# Altium project PROC154E3_SCH.PrjPcb (part 50 of 60)
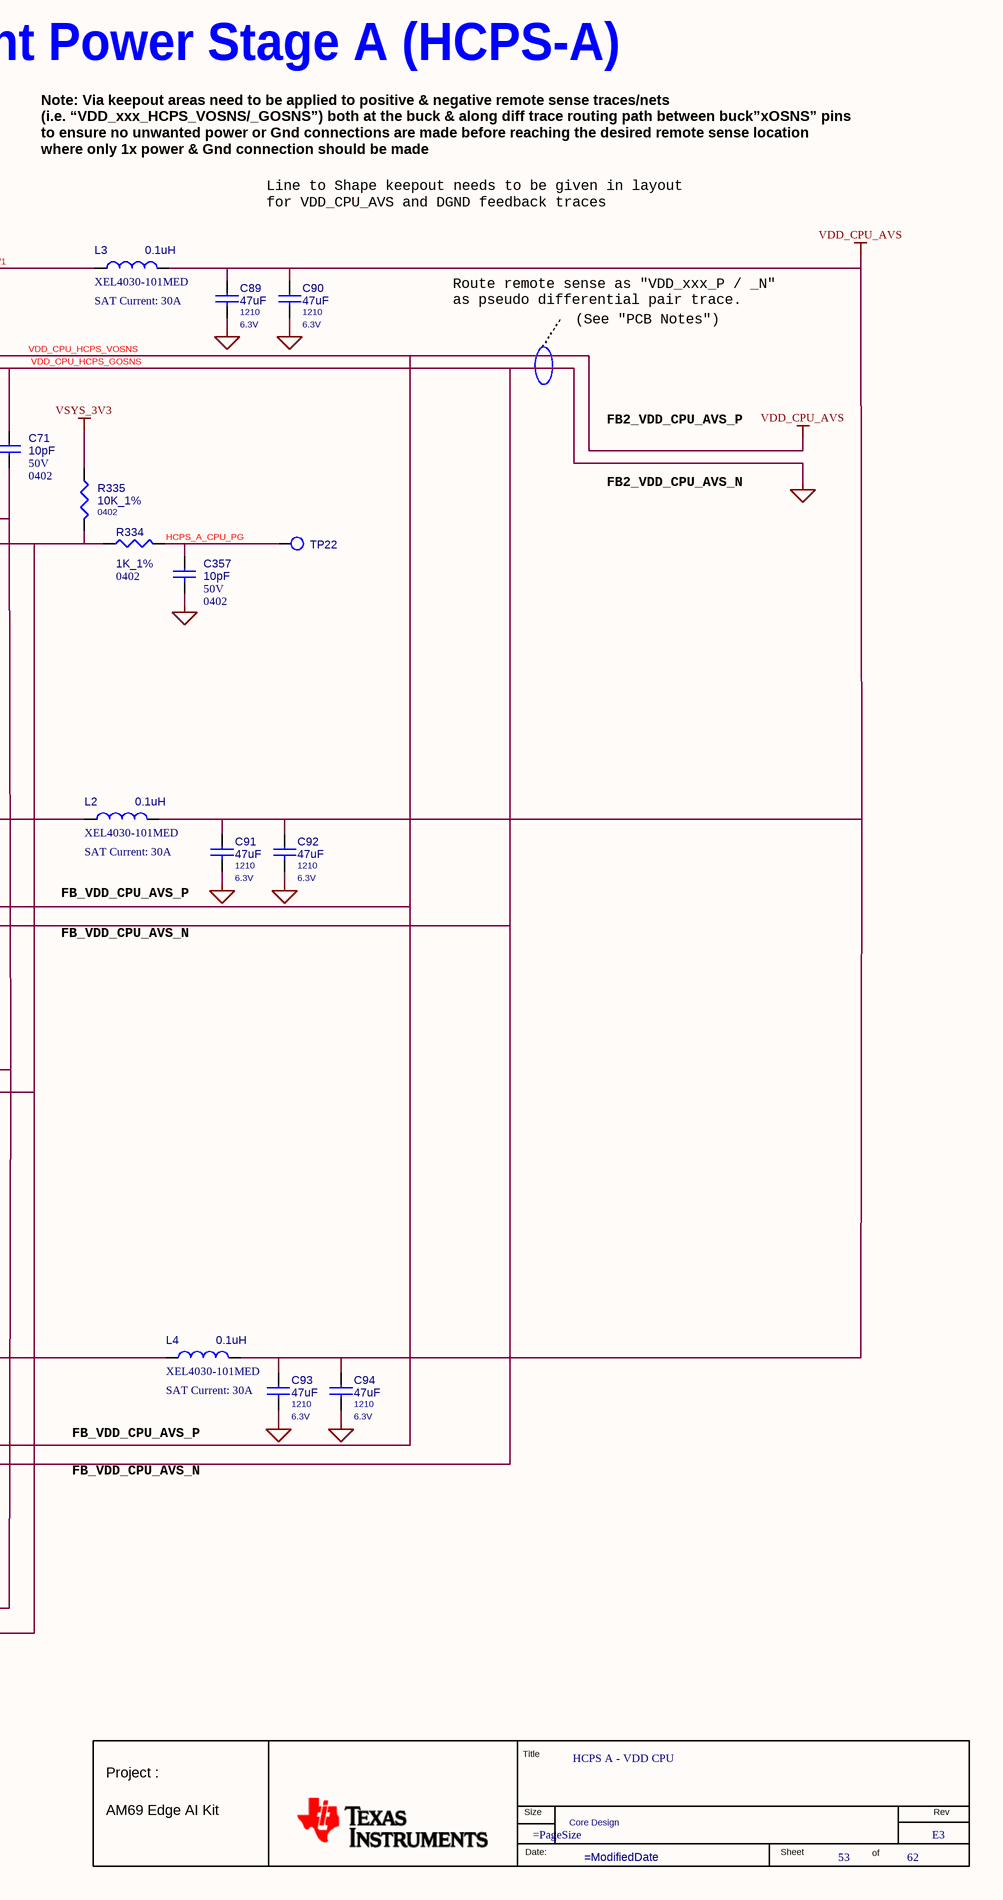
[diagram p190: 53. SOC CPU HCPS-A.SchDoc, right]

## Sheet 53. SOC CPU HCPS-A.SchDoc: HCPS A - VDD CPU (continued)

### Library data of the parts
*#53 = MISTRAL_TITLEBLK_CSIZE_1: as *#51 on sheet 51. POWER SUPPLY #2; Page Create Date: March  8, 1995; Page Size: =PageSize; Page Modify Date: =ModifiedDate; Schematic Page Count: 62; Schematic Page Number: 53
C65 = CAP_Dup1: CAP CERAMIC 10pF 50V 1% C0G(NP0) 0402; Part Reference: C65; Manufacturer: AVX CORPORATION; Automotive Alternate_mfr_part_number: CGA2B1X7R1C104K050BC; Automotive Alternate_mfr_name: TDK; Direct Alternate_mfr_part_number: GCM155R71C104JA55D; Direct Alternate_mfr_name: MURATA; Part_type: CAPACITORS\CERAMIC; Mfr_part_number: 04025U100FAT2A; Mistral Part No: 120014060010-R; Custom_Duty: 15%; Customs_HS_Code: 85322990; Wattage: NA; Project: AEGIS_POM; Value: 10pF; PCB Footprint: CAP0402_0-75; Footprint Path: Y:\MIS_DATABASE\Library\ALTIUM_TOOL\PCB_FOOTPRINTS\Altium_Footprint_Lib.PcbLib; Library Path: Y:\MIS_DATABASE\Library\ALTIUM_TOOL\SCHEMATICS_PARTS\MS_DISCRETE_Library.schlib; MECHANICAL 3D STEP FILE: CAP0402_0-75; Chkd/date: VASANTHA/200614; Crtd /date: NAVEED/170614; Datasheet: Y:\MIS_DATABASE\DATASHEETS\CAPACITORS\AVX_MLC.PDF; Temperature: -55°C+125°C; Weight: 0.65mg; Height: 0.55MM; Library Ref: CAP; Distributor_part_number: 478-5717-1-ND; Distributor_name: DIGIKEY; Tolerance: 1%; Mfr_name: AVX CORPORATION; Footprint Ref: CAP0402_0-75
C66 = CAP_Dup1: CAP CERAMIC 3300pF 50V 10% X7R 0402; Part Reference: C66; Manufacturer: MURATA; Automotive Alternate_mfr_part_number: CGA2B1X7R1C104K050BC; Automotive Alternate_mfr_name: TDK; Direct Alternate_mfr_part_number: GCM155R71C104JA55D; Part_type: CAPACITORS\CERAMIC; Mfr_part_number: GCM155R71H332KA37D; Mistral Part No: 120022080077-R; Custom_Duty: 15%; Customs_HS_Code: 85322990; Wattage: NA; Project: BRUKER_SD820_COMMONDO; Value: 3300pF; PCB Footprint: CAP0402_0-75; Direct Alternate_mfr_name: MURATA; Footprint Path: Y:\MIS_DATABASE\Library\ALTIUM_TOOL\PCB_FOOTPRINTS\Altium_Footprint_Lib.PcbLib; Library Path: Y:\MIS_DATABASE\Library\ALTIUM_TOOL\SCHEMATICS_PARTS\MS_DISCRETE_Library.schlib; MECHANICAL 3D STEP FILE: CAP0402_0-75; Chkd/date: PRAVEEN/300822; Crtd /date: PRAVEEN/300822; Datasheet: Y:\MIS_DATABASE\DATASHEETS\CAPACITORS\GCM155R71H332KA37D.PDF; Temperature: -55°C+125°C; Weight: 1.6mg; Height: 0.55MM; Library Ref: CAP; Distributor_part_number: 490-8001-1-ND; Distributor_name: DIGIKEY; Tolerance: 10%; Mfr_name: MURATA; Footprint Ref: CAP0402_0-75
C67 = CAP_Dup1: CAP CERAMIC 10pF 50V 1% C0G(NP0) 0402; Part Reference: C67; Manufacturer: AVX CORPORATION; Mistral Part No: 120014060010-R; Mfr_part_number: 04025U100FAT2A; Part_type: CAPACITORS\CERAMIC; Direct Alternate_mfr_name: MURATA; Direct Alternate_mfr_part_number: GCM155R71C104JA55D; Automotive Alternate_mfr_name: TDK; Automotive Alternate_mfr_part_number: CGA2B1X7R1C104K050BC; Project: AEGIS_POM; Wattage: NA; Customs_HS_Code: 85322990; Custom_Duty: 15%; Value: 10pF; PCB Footprint: CAP0402_0-75; Footprint Ref: CAP0402_0-75; Mfr_name: AVX CORPORATION; Tolerance: 1%; Distributor_name: DIGIKEY; Distributor_part_number: 478-5717-1-ND; Library Ref: CAP; Height: 0.55MM; Weight: 0.65mg; Temperature: -55°C+125°C; Datasheet: Y:\MIS_DATABASE\DATASHEETS\CAPACITORS\AVX_MLC.PDF; Crtd /date: NAVEED/170614; Chkd/date: VASANTHA/200614; MECHANICAL 3D STEP FILE: CAP0402_0-75; Library Path: Y:\MIS_DATABASE\Library\ALTIUM_TOOL\SCHEMATICS_PARTS\MS_DISCRETE_Library.schlib; Footprint Path: Y:\MIS_DATABASE\Library\ALTIUM_TOOL\PCB_FOOTPRINTS\Altium_Footprint_Lib.PcbLib
C71 = CAP_Dup1: CAP CERAMIC 10pF 50V 1% C0G(NP0) 0402; Part Reference: C71; Manufacturer: AVX CORPORATION; Mistral Part No: 120014060010-R; Mfr_part_number: 04025U100FAT2A; Part_type: CAPACITORS\CERAMIC; Direct Alternate_mfr_name: MURATA; Direct Alternate_mfr_part_number: GCM155R71C104JA55D; Automotive Alternate_mfr_name: TDK; Automotive Alternate_mfr_part_number: CGA2B1X7R1C104K050BC; Project: AEGIS_POM; Wattage: NA; Customs_HS_Code: 85322990; Custom_Duty: 15%; Value: 10pF; PCB Footprint: CAP0402_0-75; Footprint Ref: CAP0402_0-75; Mfr_name: AVX CORPORATION; Tolerance: 1%; Distributor_name: DIGIKEY; Distributor_part_number: 478-5717-1-ND; Library Ref: CAP; Height: 0.55MM; Weight: 0.65mg; Temperature: -55°C+125°C; Datasheet: Y:\MIS_DATABASE\DATASHEETS\CAPACITORS\AVX_MLC.PDF; Crtd /date: NAVEED/170614; Chkd/date: VASANTHA/200614; MECHANICAL 3D STEP FILE: CAP0402_0-75; Library Path: Y:\MIS_DATABASE\Library\ALTIUM_TOOL\SCHEMATICS_PARTS\MS_DISCRETE_Library.schlib; Footprint Path: Y:\MIS_DATABASE\Library\ALTIUM_TOOL\PCB_FOOTPRINTS\Altium_Footprint_Lib.PcbLib
C89 = CAP_Dup1: CAP CERAMIC 47uF 6.3V 10% X7R AUTO 1210; Part Reference: C89; Manufacturer: MURATA; Automotive Alternate_mfr_part_number: CGA6P1X7S1A476M; Automotive Alternate_mfr_name: TDK; Part_type: CAPACITORS\CERAMIC; Mfr_part_number: GCM32ER70J476KE19L; Mistral Part No: 120018090056-R; Custom_Duty: 15%; Customs_HS_Code: 85322990; Wattage: NA; Project: TI_J7_SVB-DUT; Value: 47uF; PCB Footprint: CAP1210_2-75; Direct Alternate_mfr_part_number: CGA6P1X7S1A476M; Direct Alternate_mfr_name: TDK; Footprint Path: Y:\MIS_DATABASE\Library\ALTIUM_TOOL\PCB_FOOTPRINTS\Altium_Footprint_Lib.PcbLib; Library Path: Y:\MIS_DATABASE\Library\ALTIUM_TOOL\SCHEMATICS_PARTS\MS_DISCRETE_Library.schlib; MECHANICAL 3D STEP FILE: CAP1210_2-75; Chkd/date: MANIRAJA/280918; Crtd /date: ALVY/280918; Datasheet: Y:\MIS_DATABASE\DATASHEETS\CAPACITORS\MURATA-GCM-SER.PDF; Temperature: -55°C+125°C; Weight: 110mg; Height: 2.70MM; Library Ref: CAP; Distributor_part_number: 490-4844-1-ND; Distributor_name: DIGIKEY; Tolerance: 10%; Mfr_name: MURATA; Footprint Ref: CAP1210_2-75
C90 = CAP_Dup1: CAP CERAMIC 47uF 6.3V 10% X7R AUTO 1210; Part Reference: C90; Manufacturer: MURATA; Automotive Alternate_mfr_part_number: CGA6P1X7S1A476M; Automotive Alternate_mfr_name: TDK; Part_type: CAPACITORS\CERAMIC; Mfr_part_number: GCM32ER70J476KE19L; Mistral Part No: 120018090056-R; Custom_Duty: 15%; Customs_HS_Code: 85322990; Wattage: NA; Project: TI_J7_SVB-DUT; Value: 47uF; PCB Footprint: CAP1210_2-75; Direct Alternate_mfr_part_number: CGA6P1X7S1A476M; Direct Alternate_mfr_name: TDK; Footprint Path: Y:\MIS_DATABASE\Library\ALTIUM_TOOL\PCB_FOOTPRINTS\Altium_Footprint_Lib.PcbLib; Library Path: Y:\MIS_DATABASE\Library\ALTIUM_TOOL\SCHEMATICS_PARTS\MS_DISCRETE_Library.schlib; MECHANICAL 3D STEP FILE: CAP1210_2-75; Chkd/date: MANIRAJA/280918; Crtd /date: ALVY/280918; Datasheet: Y:\MIS_DATABASE\DATASHEETS\CAPACITORS\MURATA-GCM-SER.PDF; Temperature: -55°C+125°C; Weight: 110mg; Height: 2.70MM; Library Ref: CAP; Distributor_part_number: 490-4844-1-ND; Distributor_name: DIGIKEY; Tolerance: 10%; Mfr_name: MURATA; Footprint Ref: CAP1210_2-75
C91 = CAP_Dup1: CAP CERAMIC 47uF 6.3V 10% X7R AUTO 1210; Part Reference: C91; Manufacturer: MURATA; Automotive Alternate_mfr_part_number: CGA6P1X7S1A476M; Automotive Alternate_mfr_name: TDK; Part_type: CAPACITORS\CERAMIC; Mfr_part_number: GCM32ER70J476KE19L; Mistral Part No: 120018090056-R; Custom_Duty: 15%; Customs_HS_Code: 85322990; Wattage: NA; Project: TI_J7_SVB-DUT; Value: 47uF; PCB Footprint: CAP1210_2-75; Direct Alternate_mfr_part_number: CGA6P1X7S1A476M; Direct Alternate_mfr_name: TDK; Footprint Path: Y:\MIS_DATABASE\Library\ALTIUM_TOOL\PCB_FOOTPRINTS\Altium_Footprint_Lib.PcbLib; Library Path: Y:\MIS_DATABASE\Library\ALTIUM_TOOL\SCHEMATICS_PARTS\MS_DISCRETE_Library.schlib; MECHANICAL 3D STEP FILE: CAP1210_2-75; Chkd/date: MANIRAJA/280918; Crtd /date: ALVY/280918; Datasheet: Y:\MIS_DATABASE\DATASHEETS\CAPACITORS\MURATA-GCM-SER.PDF; Temperature: -55°C+125°C; Weight: 110mg; Height: 2.70MM; Library Ref: CAP; Distributor_part_number: 490-4844-1-ND; Distributor_name: DIGIKEY; Tolerance: 10%; Mfr_name: MURATA; Footprint Ref: CAP1210_2-75
C92 = CAP_Dup1: CAP CERAMIC 47uF 6.3V 10% X7R AUTO 1210; Part Reference: C92; Manufacturer: MURATA; Automotive Alternate_mfr_part_number: CGA6P1X7S1A476M; Automotive Alternate_mfr_name: TDK; Part_type: CAPACITORS\CERAMIC; Mfr_part_number: GCM32ER70J476KE19L; Mistral Part No: 120018090056-R; Custom_Duty: 15%; Customs_HS_Code: 85322990; Wattage: NA; Project: TI_J7_SVB-DUT; Value: 47uF; PCB Footprint: CAP1210_2-75; Direct Alternate_mfr_part_number: CGA6P1X7S1A476M; Direct Alternate_mfr_name: TDK; Footprint Path: Y:\MIS_DATABASE\Library\ALTIUM_TOOL\PCB_FOOTPRINTS\Altium_Footprint_Lib.PcbLib; Library Path: Y:\MIS_DATABASE\Library\ALTIUM_TOOL\SCHEMATICS_PARTS\MS_DISCRETE_Library.schlib; MECHANICAL 3D STEP FILE: CAP1210_2-75; Chkd/date: MANIRAJA/280918; Crtd /date: ALVY/280918; Datasheet: Y:\MIS_DATABASE\DATASHEETS\CAPACITORS\MURATA-GCM-SER.PDF; Temperature: -55°C+125°C; Weight: 110mg; Height: 2.70MM; Library Ref: CAP; Distributor_part_number: 490-4844-1-ND; Distributor_name: DIGIKEY; Tolerance: 10%; Mfr_name: MURATA; Footprint Ref: CAP1210_2-75
C93 = CAP_Dup1: CAP CERAMIC 47uF 6.3V 10% X7R AUTO 1210; Part Reference: C93; Manufacturer: MURATA; Mistral Part No: 120018090056-R; Mfr_part_number: GCM32ER70J476KE19L; Part_type: CAPACITORS\CERAMIC; Direct Alternate_mfr_name: TDK; Direct Alternate_mfr_part_number: CGA6P1X7S1A476M; Project: TI_J7_SVB-DUT; Wattage: NA; Customs_HS_Code: 85322990; Custom_Duty: 15%; Value: 47uF; PCB Footprint: CAP1210_2-75; Footprint Ref: CAP1210_2-75; Mfr_name: MURATA; Tolerance: 10%; Distributor_name: DIGIKEY; Distributor_part_number: 490-4844-1-ND; Library Ref: CAP; Height: 2.70MM; Weight: 110mg; Temperature: -55°C+125°C; Datasheet: Y:\MIS_DATABASE\DATASHEETS\CAPACITORS\MURATA-GCM-SER.PDF; Crtd /date: ALVY/280918; Chkd/date: MANIRAJA/280918; MECHANICAL 3D STEP FILE: CAP1210_2-75; Library Path: Y:\MIS_DATABASE\Library\ALTIUM_TOOL\SCHEMATICS_PARTS\MS_DISCRETE_Library.schlib; Footprint Path: Y:\MIS_DATABASE\Library\ALTIUM_TOOL\PCB_FOOTPRINTS\Altium_Footprint_Lib.PcbLib; Automotive Alternate_mfr_name: TDK; Automotive Alternate_mfr_part_number: CGA6P1X7S1A476M
C94 = CAP_Dup1: CAP CERAMIC 47uF 6.3V 10% X7R AUTO 1210; Part Reference: C94; Manufacturer: MURATA; Mistral Part No: 120018090056-R; Mfr_part_number: GCM32ER70J476KE19L; Part_type: CAPACITORS\CERAMIC; Direct Alternate_mfr_name: TDK; Direct Alternate_mfr_part_number: CGA6P1X7S1A476M; Project: TI_J7_SVB-DUT; Wattage: NA; Customs_HS_Code: 85322990; Custom_Duty: 15%; Value: 47uF; PCB Footprint: CAP1210_2-75; Footprint Ref: CAP1210_2-75; Mfr_name: MURATA; Tolerance: 10%; Distributor_name: DIGIKEY; Distributor_part_number: 490-4844-1-ND; Library Ref: CAP; Height: 2.70MM; Weight: 110mg; Temperature: -55°C+125°C; Datasheet: Y:\MIS_DATABASE\DATASHEETS\CAPACITORS\MURATA-GCM-SER.PDF; Crtd /date: ALVY/280918; Chkd/date: MANIRAJA/280918; MECHANICAL 3D STEP FILE: CAP1210_2-75; Library Path: Y:\MIS_DATABASE\Library\ALTIUM_TOOL\SCHEMATICS_PARTS\MS_DISCRETE_Library.schlib; Footprint Path: Y:\MIS_DATABASE\Library\ALTIUM_TOOL\PCB_FOOTPRINTS\Altium_Footprint_Lib.PcbLib; Automotive Alternate_mfr_name: TDK; Automotive Alternate_mfr_part_number: CGA6P1X7S1A476M
C357 = CAP_Dup1: CAP CERAMIC 10pF 50V 1% C0G(NP0) 0402; Part Reference: C357; Manufacturer: AVX CORPORATION; Automotive Alternate_mfr_part_number: CGA2B1X7R1C104K050BC; Automotive Alternate_mfr_name: TDK; Direct Alternate_mfr_part_number: GCM155R71C104JA55D; Direct Alternate_mfr_name: MURATA; Part_type: CAPACITORS\CERAMIC; Mfr_part_number: 04025U100FAT2A; Mistral Part No: 120014060010-R; Custom_Duty: 15%; Customs_HS_Code: 85322990; Wattage: NA; Project: AEGIS_POM; Value: 10pF; PCB Footprint: CAP0402_0-75; Footprint Path: Y:\MIS_DATABASE\Library\ALTIUM_TOOL\PCB_FOOTPRINTS\Altium_Footprint_Lib.PcbLib; Library Path: Y:\MIS_DATABASE\Library\ALTIUM_TOOL\SCHEMATICS_PARTS\MS_DISCRETE_Library.schlib; MECHANICAL 3D STEP FILE: CAP0402_0-75; Chkd/date: VASANTHA/200614; Crtd /date: NAVEED/170614; Datasheet: Y:\MIS_DATABASE\DATASHEETS\CAPACITORS\AVX_MLC.PDF; Temperature: -55°C+125°C; Weight: 0.65mg; Height: 0.55MM; Library Ref: CAP; Distributor_part_number: 478-5717-1-ND; Distributor_name: DIGIKEY; Tolerance: 1%; Mfr_name: AVX CORPORATION; Footprint Ref: CAP0402_0-75
FL1 = CAP_NFM_TI: PASSIVE FILTER EMI 10uF 4V AUTO 0603; Part Reference: FL1; Mistral Part No: 130018100049; Mfr_name: MURATA; Mfr_part_number: NFM18HC106D0G_TI; Project: TI_J7ES_EVM_SOM; Tolerance: NA; Customs_HS_Code: 85412900; Custom_Duty: 15%; Value: 10uF; Footprint Ref: EMIFIL_NFM18C_0603_0-7_TI; Part_type: FILTER; Voltage: 4V; Wattage: NA; Package: 0603; Distributor_name: NA; Distributor_part_number: NA; Library Ref: CAP_NFM_TI; PCB Footprint: EMIFIL_NFM18C_0603_0-7_TI; Height: 0.70MM; Weight: NA; Temperature: NA; Datasheet: Y:\MIS_DATABASE\DATASHEETS\DISCRETES\INDUCTORS\NFM18HC-SER.PDF; Crtd /date: ALVY/251018; Chkd/date: MANIRAJA/251018; RoHS: NA; MECHANICAL 3D STEP FILE: EMIFIL_NFM18C_0603_0-7_TI; Library Path: Y:\MIS_DATABASE\Library\ALTIUM_TOOL\SCHEMATICS_PARTS\MS_FILTER_Library.schlib; Footprint Path: Y:\MIS_DATABASE\Library\ALTIUM_TOOL\PCB_FOOTPRINTS\Altium_Footprint_Lib.PcbLib
FL2 = CAP_NFM_TI: PASSIVE FILTER EMI 10uF 4V AUTO 0603; Part Reference: FL2; Mistral Part No: 130018100049; Mfr_name: MURATA; Mfr_part_number: NFM18HC106D0G_TI; Project: TI_J7ES_EVM_SOM; Tolerance: NA; Customs_HS_Code: 85412900; Custom_Duty: 15%; Value: 10uF; Footprint Ref: EMIFIL_NFM18C_0603_0-7_TI; Part_type: FILTER; Voltage: 4V; Wattage: NA; Package: 0603; Distributor_name: NA; Distributor_part_number: NA; Library Ref: CAP_NFM_TI; PCB Footprint: EMIFIL_NFM18C_0603_0-7_TI; Height: 0.70MM; Weight: NA; Temperature: NA; Datasheet: Y:\MIS_DATABASE\DATASHEETS\DISCRETES\INDUCTORS\NFM18HC-SER.PDF; Crtd /date: ALVY/251018; Chkd/date: MANIRAJA/251018; RoHS: NA; MECHANICAL 3D STEP FILE: EMIFIL_NFM18C_0603_0-7_TI; Library Path: Y:\MIS_DATABASE\Library\ALTIUM_TOOL\SCHEMATICS_PARTS\MS_FILTER_Library.schlib; Footprint Path: Y:\MIS_DATABASE\Library\ALTIUM_TOOL\PCB_FOOTPRINTS\Altium_Footprint_Lib.PcbLib
FL3 = CAP_NFM_TI: PASSIVE FILTER EMI 10uF 4V AUTO 0603; Part Reference: FL3; Mistral Part No: 130018100049; Mfr_name: MURATA; Mfr_part_number: NFM18HC106D0G_TI; Project: TI_J7ES_EVM_SOM; Tolerance: NA; Customs_HS_Code: 85412900; Custom_Duty: 15%; Value: 10uF; Footprint Ref: EMIFIL_NFM18C_0603_0-7_TI; Part_type: FILTER; Voltage: 4V; Wattage: NA; Package: 0603; Distributor_name: NA; Distributor_part_number: NA; Library Ref: CAP_NFM_TI; PCB Footprint: EMIFIL_NFM18C_0603_0-7_TI; Height: 0.70MM; Weight: NA; Temperature: NA; Datasheet: Y:\MIS_DATABASE\DATASHEETS\DISCRETES\INDUCTORS\NFM18HC-SER.PDF; Crtd /date: ALVY/251018; Chkd/date: MANIRAJA/251018; RoHS: NA; MECHANICAL 3D STEP FILE: EMIFIL_NFM18C_0603_0-7_TI; Library Path: Y:\MIS_DATABASE\Library\ALTIUM_TOOL\SCHEMATICS_PARTS\MS_FILTER_Library.schlib; Footprint Path: Y:\MIS_DATABASE\Library\ALTIUM_TOOL\PCB_FOOTPRINTS\Altium_Footprint_Lib.PcbLib
FL4 = CAP_NFM_TI: PASSIVE FILTER EMI 10uF 4V AUTO 0603; Part Reference: FL4; Mistral Part No: 130018100049; Mfr_name: MURATA; Mfr_part_number: NFM18HC106D0G_TI; Project: TI_J7ES_EVM_SOM; Tolerance: NA; Customs_HS_Code: 85412900; Custom_Duty: 15%; Value: 10uF; Footprint Ref: EMIFIL_NFM18C_0603_0-7_TI; Part_type: FILTER; Voltage: 4V; Wattage: NA; Package: 0603; Distributor_name: NA; Distributor_part_number: NA; Library Ref: CAP_NFM_TI; PCB Footprint: EMIFIL_NFM18C_0603_0-7_TI; Height: 0.70MM; Weight: NA; Temperature: NA; Datasheet: Y:\MIS_DATABASE\DATASHEETS\DISCRETES\INDUCTORS\NFM18HC-SER.PDF; Crtd /date: ALVY/251018; Chkd/date: MANIRAJA/251018; RoHS: NA; MECHANICAL 3D STEP FILE: EMIFIL_NFM18C_0603_0-7_TI; Library Path: Y:\MIS_DATABASE\Library\ALTIUM_TOOL\SCHEMATICS_PARTS\MS_FILTER_Library.schlib; Footprint Path: Y:\MIS_DATABASE\Library\ALTIUM_TOOL\PCB_FOOTPRINTS\Altium_Footprint_Lib.PcbLib
FL5 = CAP_NFM_TI: PASSIVE FILTER EMI 10uF 4V AUTO 0603; Part Reference: FL5; Mistral Part No: 130018100049; Mfr_name: MURATA; Mfr_part_number: NFM18HC106D0G_TI; Project: TI_J7ES_EVM_SOM; Tolerance: NA; Customs_HS_Code: 85412900; Custom_Duty: 15%; Value: 10uF; Footprint Ref: EMIFIL_NFM18C_0603_0-7_TI; Part_type: FILTER; Voltage: 4V; Wattage: NA; Package: 0603; Distributor_name: NA; Distributor_part_number: NA; Library Ref: CAP_NFM_TI; PCB Footprint: EMIFIL_NFM18C_0603_0-7_TI; Height: 0.70MM; Weight: NA; Temperature: NA; Datasheet: Y:\MIS_DATABASE\DATASHEETS\DISCRETES\INDUCTORS\NFM18HC-SER.PDF; Crtd /date: ALVY/251018; Chkd/date: MANIRAJA/251018; RoHS: NA; MECHANICAL 3D STEP FILE: EMIFIL_NFM18C_0603_0-7_TI; Library Path: Y:\MIS_DATABASE\Library\ALTIUM_TOOL\SCHEMATICS_PARTS\MS_FILTER_Library.schlib; Footprint Path: Y:\MIS_DATABASE\Library\ALTIUM_TOOL\PCB_FOOTPRINTS\Altium_Footprint_Lib.PcbLib
FL6 = CAP_NFM_TI: PASSIVE FILTER EMI 10uF 4V AUTO 0603; Part Reference: FL6; Mistral Part No: 130018100049; Mfr_name: MURATA; Mfr_part_number: NFM18HC106D0G_TI; Project: TI_J7ES_EVM_SOM; Tolerance: NA; Customs_HS_Code: 85412900; Custom_Duty: 15%; Value: 10uF; Footprint Ref: EMIFIL_NFM18C_0603_0-7_TI; Part_type: FILTER; Voltage: 4V; Wattage: NA; Package: 0603; Distributor_name: NA; Distributor_part_number: NA; Library Ref: CAP_NFM_TI; PCB Footprint: EMIFIL_NFM18C_0603_0-7_TI; Height: 0.70MM; Weight: NA; Temperature: NA; Datasheet: Y:\MIS_DATABASE\DATASHEETS\DISCRETES\INDUCTORS\NFM18HC-SER.PDF; Crtd /date: ALVY/251018; Chkd/date: MANIRAJA/251018; RoHS: NA; MECHANICAL 3D STEP FILE: EMIFIL_NFM18C_0603_0-7_TI; Library Path: Y:\MIS_DATABASE\Library\ALTIUM_TOOL\SCHEMATICS_PARTS\MS_FILTER_Library.schlib; Footprint Path: Y:\MIS_DATABASE\Library\ALTIUM_TOOL\PCB_FOOTPRINTS\Altium_Footprint_Lib.PcbLib
FL7 = CAP_NFM_TI: PASSIVE FILTER EMI 10uF 4V AUTO 0603; Part Reference: FL7; Mistral Part No: 130018100049; Mfr_name: MURATA; Mfr_part_number: NFM18HC106D0G_TI; Project: TI_J7ES_EVM_SOM; Tolerance: NA; Customs_HS_Code: 85412900; Custom_Duty: 15%; Value: 10uF; Footprint Ref: EMIFIL_NFM18C_0603_0-7_TI; Part_type: FILTER; Voltage: 4V; Wattage: NA; Package: 0603; Distributor_name: NA; Distributor_part_number: NA; Library Ref: CAP_NFM_TI; PCB Footprint: EMIFIL_NFM18C_0603_0-7_TI; Height: 0.70MM; Weight: NA; Temperature: NA; Datasheet: Y:\MIS_DATABASE\DATASHEETS\DISCRETES\INDUCTORS\NFM18HC-SER.PDF; Crtd /date: ALVY/251018; Chkd/date: MANIRAJA/251018; RoHS: NA; MECHANICAL 3D STEP FILE: EMIFIL_NFM18C_0603_0-7_TI; Library Path: Y:\MIS_DATABASE\Library\ALTIUM_TOOL\SCHEMATICS_PARTS\MS_FILTER_Library.schlib; Footprint Path: Y:\MIS_DATABASE\Library\ALTIUM_TOOL\PCB_FOOTPRINTS\Altium_Footprint_Lib.PcbLib
FL8 = CAP_NFM_TI: PASSIVE FILTER EMI 10uF 4V AUTO 0603; Part Reference: FL8; Mistral Part No: 130018100049; Mfr_name: MURATA; Mfr_part_number: NFM18HC106D0G_TI; Project: TI_J7ES_EVM_SOM; Tolerance: NA; Customs_HS_Code: 85412900; Custom_Duty: 15%; Value: 10uF; Footprint Ref: EMIFIL_NFM18C_0603_0-7_TI; Part_type: FILTER; Voltage: 4V; Wattage: NA; Package: 0603; Distributor_name: NA; Distributor_part_number: NA; Library Ref: CAP_NFM_TI; PCB Footprint: EMIFIL_NFM18C_0603_0-7_TI; Height: 0.70MM; Weight: NA; Temperature: NA; Datasheet: Y:\MIS_DATABASE\DATASHEETS\DISCRETES\INDUCTORS\NFM18HC-SER.PDF; Crtd /date: ALVY/251018; Chkd/date: MANIRAJA/251018; RoHS: NA; MECHANICAL 3D STEP FILE: EMIFIL_NFM18C_0603_0-7_TI; Library Path: Y:\MIS_DATABASE\Library\ALTIUM_TOOL\SCHEMATICS_PARTS\MS_FILTER_Library.schlib; Footprint Path: Y:\MIS_DATABASE\Library\ALTIUM_TOOL\PCB_FOOTPRINTS\Altium_Footprint_Lib.PcbLib
FL9 = CAP_NFM_TI: PASSIVE FILTER EMI 10uF 4V AUTO 0603; Part Reference: FL9; Mistral Part No: 130018100049; Mfr_name: MURATA; Mfr_part_number: NFM18HC106D0G_TI; Project: TI_J7ES_EVM_SOM; Tolerance: NA; Customs_HS_Code: 85412900; Custom_Duty: 15%; Value: 10uF; Footprint Ref: EMIFIL_NFM18C_0603_0-7_TI; Part_type: FILTER; Voltage: 4V; Wattage: NA; Package: 0603; Distributor_name: NA; Distributor_part_number: NA; Library Ref: CAP_NFM_TI; PCB Footprint: EMIFIL_NFM18C_0603_0-7_TI; Height: 0.70MM; Weight: NA; Temperature: NA; Datasheet: Y:\MIS_DATABASE\DATASHEETS\DISCRETES\INDUCTORS\NFM18HC-SER.PDF; Crtd /date: ALVY/251018; Chkd/date: MANIRAJA/251018; RoHS: NA; MECHANICAL 3D STEP FILE: EMIFIL_NFM18C_0603_0-7_TI; Library Path: Y:\MIS_DATABASE\Library\ALTIUM_TOOL\SCHEMATICS_PARTS\MS_FILTER_Library.schlib; Footprint Path: Y:\MIS_DATABASE\Library\ALTIUM_TOOL\PCB_FOOTPRINTS\Altium_Footprint_Lib.PcbLib
FL10 = CAP_NFM_TI: PASSIVE FILTER EMI 10uF 4V AUTO 0603; Part Reference: FL10; Mistral Part No: 130018100049; Mfr_name: MURATA; Mfr_part_number: NFM18HC106D0G_TI; Project: TI_J7ES_EVM_SOM; Tolerance: NA; Customs_HS_Code: 85412900; Custom_Duty: 15%; Value: 10uF; Footprint Ref: EMIFIL_NFM18C_0603_0-7_TI; Part_type: FILTER; Voltage: 4V; Wattage: NA; Package: 0603; Distributor_name: NA; Distributor_part_number: NA; Library Ref: CAP_NFM_TI; PCB Footprint: EMIFIL_NFM18C_0603_0-7_TI; Height: 0.70MM; Weight: NA; Temperature: NA; Datasheet: Y:\MIS_DATABASE\DATASHEETS\DISCRETES\INDUCTORS\NFM18HC-SER.PDF; Crtd /date: ALVY/251018; Chkd/date: MANIRAJA/251018; RoHS: NA; MECHANICAL 3D STEP FILE: EMIFIL_NFM18C_0603_0-7_TI; Library Path: Y:\MIS_DATABASE\Library\ALTIUM_TOOL\SCHEMATICS_PARTS\MS_FILTER_Library.schlib; Footprint Path: Y:\MIS_DATABASE\Library\ALTIUM_TOOL\PCB_FOOTPRINTS\Altium_Footprint_Lib.PcbLib
FL11 = CAP_NFM_TI: PASSIVE FILTER EMI 10uF 4V AUTO 0603; Part Reference: FL11; Mistral Part No: 130018100049; Mfr_name: MURATA; Mfr_part_number: NFM18HC106D0G_TI; Project: TI_J7ES_EVM_SOM; Tolerance: NA; Customs_HS_Code: 85412900; Custom_Duty: 15%; Value: 10uF; Footprint Ref: EMIFIL_NFM18C_0603_0-7_TI; Part_type: FILTER; Voltage: 4V; Wattage: NA; Package: 0603; Distributor_name: NA; Distributor_part_number: NA; Library Ref: CAP_NFM_TI; PCB Footprint: EMIFIL_NFM18C_0603_0-7_TI; Height: 0.70MM; Weight: NA; Temperature: NA; Datasheet: Y:\MIS_DATABASE\DATASHEETS\DISCRETES\INDUCTORS\NFM18HC-SER.PDF; Crtd /date: ALVY/251018; Chkd/date: MANIRAJA/251018; RoHS: NA; MECHANICAL 3D STEP FILE: EMIFIL_NFM18C_0603_0-7_TI; Library Path: Y:\MIS_DATABASE\Library\ALTIUM_TOOL\SCHEMATICS_PARTS\MS_FILTER_Library.schlib; Footprint Path: Y:\MIS_DATABASE\Library\ALTIUM_TOOL\PCB_FOOTPRINTS\Altium_Footprint_Lib.PcbLib
FL12 = CAP_NFM_TI: PASSIVE FILTER EMI 10uF 4V AUTO 0603; Part Reference: FL12; Mistral Part No: 130018100049; Mfr_name: MURATA; Mfr_part_number: NFM18HC106D0G_TI; Project: TI_J7ES_EVM_SOM; Tolerance: NA; Customs_HS_Code: 85412900; Custom_Duty: 15%; Value: 10uF; Footprint Ref: EMIFIL_NFM18C_0603_0-7_TI; Part_type: FILTER; Voltage: 4V; Wattage: NA; Package: 0603; Distributor_name: NA; Distributor_part_number: NA; Library Ref: CAP_NFM_TI; PCB Footprint: EMIFIL_NFM18C_0603_0-7_TI; Height: 0.70MM; Weight: NA; Temperature: NA; Datasheet: Y:\MIS_DATABASE\DATASHEETS\DISCRETES\INDUCTORS\NFM18HC-SER.PDF; Crtd /date: ALVY/251018; Chkd/date: MANIRAJA/251018; RoHS: NA; MECHANICAL 3D STEP FILE: EMIFIL_NFM18C_0603_0-7_TI; Library Path: Y:\MIS_DATABASE\Library\ALTIUM_TOOL\SCHEMATICS_PARTS\MS_FILTER_Library.schlib; Footprint Path: Y:\MIS_DATABASE\Library\ALTIUM_TOOL\PCB_FOOTPRINTS\Altium_Footprint_Lib.PcbLib
L2 = INDUCTOR: IND POWER 0.1uH 25.8A 20% SMD; Part Reference: L2; Manufacturer: COILCRAFT; Part #: 105324-1470R; Mistral Part No: 130022010018-R; Custom_Duty: 24%; Customs_HS_Code: 85437099; Wattage: NA; Project: J7AHP_PROTO_BRD; Value: 0.1uH; PCB Footprint: IND_XEL4030_170X170_SMD_3-2; Footprint Path: Y:\MIS_DATABASE\Library\ALTIUM_TOOL\PCB_FOOTPRINTS\Altium_Footprint_Lib.PcbLib; Library Path: Y:\MIS_DATABASE\Library\ALTIUM_TOOL\SCHEMATICS_PARTS\MS_DISCRETE_Library.schlib; MECHANICAL 3D STEP FILE: IND_XEL4030_170X170_SMD_3-2; Chkd/date: MANIRAJA/170122; Crtd /date: TAMILARASU/170122; Datasheet: Y:\MIS_DATABASE\DATASHEETS\DISCRETES\INDUCTORS\XEL4030_JUN20.PDF; Temperature: -40°C+125°C; Weight: 280mg; Height: 3.20MM; Library Ref: INDUCTOR; Distributor_part_number: 994-XEL4030-101MED; Distributor_name: MOUSER; Package: SMD; Voltage: NA; Tolerance: 20%; Part_type: INDUCTOR; Mfr_name: COILCRAFT; Footprint Ref: IND_XEL4030_170X170_SMD_3-2
L3 = INDUCTOR: IND POWER 0.1uH 25.8A 20% SMD; Part Reference: L3; Manufacturer: COILCRAFT; Part #: 105324-1470R; Mistral Part No: 130022010018-R; Custom_Duty: 24%; Customs_HS_Code: 85437099; Wattage: NA; Project: J7AHP_PROTO_BRD; Value: 0.1uH; PCB Footprint: IND_XEL4030_170X170_SMD_3-2; Footprint Path: Y:\MIS_DATABASE\Library\ALTIUM_TOOL\PCB_FOOTPRINTS\Altium_Footprint_Lib.PcbLib; Library Path: Y:\MIS_DATABASE\Library\ALTIUM_TOOL\SCHEMATICS_PARTS\MS_DISCRETE_Library.schlib; MECHANICAL 3D STEP FILE: IND_XEL4030_170X170_SMD_3-2; Chkd/date: MANIRAJA/170122; Crtd /date: TAMILARASU/170122; Datasheet: Y:\MIS_DATABASE\DATASHEETS\DISCRETES\INDUCTORS\XEL4030_JUN20.PDF; Temperature: -40°C+125°C; Weight: 280mg; Height: 3.20MM; Library Ref: INDUCTOR; Distributor_part_number: 994-XEL4030-101MED; Distributor_name: MOUSER; Package: SMD; Voltage: NA; Tolerance: 20%; Part_type: INDUCTOR; Mfr_name: COILCRAFT; Footprint Ref: IND_XEL4030_170X170_SMD_3-2
L4 = INDUCTOR: IND POWER 0.1uH 25.8A 20% SMD; Part Reference: L4; Manufacturer: COILCRAFT; Mistral Part No: 130022010018-R; Part #: 105324-1470R; Project: J7AHP_PROTO_BRD; Voltage: NA; Customs_HS_Code: 85437099; Custom_Duty: 24%; Value: 0.1uH; PCB Footprint: IND_XEL4030_170X170_SMD_3-2; Footprint Ref: IND_XEL4030_170X170_SMD_3-2; Mfr_name: COILCRAFT; Part_type: INDUCTOR; Tolerance: 20%; Wattage: NA; Package: SMD; Distributor_name: MOUSER; Distributor_part_number: 994-XEL4030-101MED; Library Ref: INDUCTOR; Height: 3.20MM; Weight: 280mg; Temperature: -40°C+125°C; Datasheet: Y:\MIS_DATABASE\DATASHEETS\DISCRETES\INDUCTORS\XEL4030_JUN20.PDF; Crtd /date: TAMILARASU/170122; Chkd/date: MANIRAJA/170122; MECHANICAL 3D STEP FILE: IND_XEL4030_170X170_SMD_3-2; Library Path: Y:\MIS_DATABASE\Library\ALTIUM_TOOL\SCHEMATICS_PARTS\MS_DISCRETE_Library.schlib; Footprint Path: Y:\MIS_DATABASE\Library\ALTIUM_TOOL\PCB_FOOTPRINTS\Altium_Footprint_Lib.PcbLib
R62 = RESISTOR_Dup2: RES 1.8K 1/16W 5% AUTO 0402; Part Reference: R62; Manufacturer: YAGEO; Part_type: RESISTORS\FIXED; Mfr_part_number: RC0402JR-071K8L; Mistral Part No: 110009030147-R; Custom_Duty: 15%; Customs_HS_Code: 85332119; Voltage: NA; Project: MARP; Value: 1.8K; PCB Footprint: RES0402_0-5; Footprint Path: Y:\MIS_DATABASE\Library\ALTIUM_TOOL\PCB_FOOTPRINTS\Altium_Footprint_Lib.PcbLib; Library Path: Y:\MIS_DATABASE\Library\ALTIUM_TOOL\SCHEMATICS_PARTS\MS_DISCRETE_Library.schlib; MECHANICAL 3D STEP FILE: RES0402_0-5; Chkd/date: MAZHAR/170709; Crtd /date: MAZHAR/200907; Datasheet: Y:\MIS_DATABASE\DATASHEETS\RESISTORS\MCR10.PDF; Temperature: -55°C+155°C; Weight: 0.57mg; Height: 0.40MM; Library Ref: RESISTOR; Distributor_part_number: RHM1.8KJCT-ND; Distributor_name: DIGIKEY; Wattage: 1/16W; Tolerance: 5%; Mfr_name: YAGEO; Footprint Ref: RES0402_0-5
R63 = RESISTOR_Dup2: RES 10K 1/16W 1% 0402; Part Reference: R63; Manufacturer: YAGEO AMERICA; Part_type: RESISTORS\FIXED; Mfr_part_number: RC0402FR-0710KL; Mistral Part No: 110015090015-R; Custom_Duty: 15%; Customs_HS_Code: 85332119; Voltage: NA; Project: VOCERA; Value: 10K_1%; PCB Footprint: RES0402_0-5; Footprint Path: Y:\MIS_DATABASE\Library\ALTIUM_TOOL\PCB_FOOTPRINTS\Altium_Footprint_Lib.PcbLib; Library Path: Y:\MIS_DATABASE\Library\ALTIUM_TOOL\SCHEMATICS_PARTS\MS_DISCRETE_Library.schlib; MECHANICAL 3D STEP FILE: RES0402_0-5; Chkd/date: VASANTHA/201216; Crtd /date: GEETHA/290506; Datasheet: Y:\MIS_DATABASE\DATASHEETS\RESISTORS\RCXXXXL-SER_MAR18.PDF; Temperature: -55°C+155°C; Weight: 0.65mg; Height: 0.40MM; Library Ref: RESISTOR; Distributor_part_number: 311-10.0KLRTR-ND; Distributor_name: DIGIKEY; Wattage: 1/16W; Tolerance: 1%; Mfr_name: YAGEO AMERICA; Footprint Ref: RES0402_0-5
R64 = RESISTOR_Dup2: RES 6.19K 1/16W 1% 0402; Part Reference: R64; Manufacturer: YAGEO AMERICA; Part_type: RESISTORS\FIXED; Mfr_part_number: RC0402FR-076K19L; Mistral Part No: 110022010013-R; Custom_Duty: 15%; Customs_HS_Code: 85332119; Voltage: NA; Project: J7AHP_PROTO_BRD; Value: 6.19K_1%; PCB Footprint: RES0402_0-5; Footprint Path: Y:\MIS_DATABASE\Library\ALTIUM_TOOL\PCB_FOOTPRINTS\Altium_Footprint_Lib.PcbLib; Library Path: Y:\MIS_DATABASE\Library\ALTIUM_TOOL\SCHEMATICS_PARTS\MS_DISCRETE_Library.schlib; MECHANICAL 3D STEP FILE: RES0402_0-5; Chkd/date: MANIRAJA/190122; Crtd /date: TAMILARASU/190122; Datasheet: Y:\MIS_DATABASE\DATASHEETS\RESISTORS\RCXXXXL-SER_MAR18.PDF; Temperature: -55°C+155°C; Weight: 0.65mg; Height: 0.40MM; Library Ref: RESISTOR; Distributor_part_number: 311-6.19KLRCT-ND; Distributor_name: DIGIKEY; Wattage: 1/16W; Tolerance: 1%; Mfr_name: YAGEO AMERICA; Footprint Ref: RES0402_0-5
R65 = RESISTOR_Dup2: RES 47.5K 1/16W 1% 0402; Part Reference: R65; Mistral Part No: 110017010006-R; Mfr_name: VISHAY; Mfr_part_number: CRCW040247K5FKED; Part_type: RESISTORS\FIXED; Project: TPR12_SVB; Voltage: NA; Customs_HS_Code: 85332119; Custom_Duty: 15%; Value: 47.5K_1%; Footprint Ref: RES0402_0-5; Tolerance: 1%; Wattage: 1/16W; Distributor_name: DIGIKEY; Distributor_part_number: 541-47.5KLCT-ND; Library Ref: RESISTOR; Height: 0.40MM; Weight: 0.65mg; Temperature: -55°C+155°C; Datasheet: Y:\MIS_DATABASE\DATASHEETS\RESISTORS\CRCW0603.PDF; Crtd /date: MANIRAJA/170320; Chkd/date: MANIRAJA/170320; MECHANICAL 3D STEP FILE: RES0402_0-5; Library Path: Y:\MIS_DATABASE\Library\ALTIUM_TOOL\SCHEMATICS_PARTS\MS_DISCRETE_Library.schlib; Footprint Path: Y:\MIS_DATABASE\Library\ALTIUM_TOOL\PCB_FOOTPRINTS\Altium_Footprint_Lib.PcbLib; Manufacturer: VISHAY; PCB Footprint: RES0402_0-5
R66 = RESISTOR_Dup2: RES 10K 1/16W 1% 0402; Part Reference: R66; Manufacturer: YAGEO AMERICA; Part_type: RESISTORS\FIXED; Mfr_part_number: RC0402FR-0710KL; Mistral Part No: 110015090015-R; Custom_Duty: 15%; Customs_HS_Code: 85332119; Voltage: NA; Project: VOCERA; Value: 10K_1%; PCB Footprint: RES0402_0-5; Footprint Path: Y:\MIS_DATABASE\Library\ALTIUM_TOOL\PCB_FOOTPRINTS\Altium_Footprint_Lib.PcbLib; Library Path: Y:\MIS_DATABASE\Library\ALTIUM_TOOL\SCHEMATICS_PARTS\MS_DISCRETE_Library.schlib; MECHANICAL 3D STEP FILE: RES0402_0-5; Chkd/date: VASANTHA/201216; Crtd /date: GEETHA/290506; Datasheet: Y:\MIS_DATABASE\DATASHEETS\RESISTORS\RCXXXXL-SER_MAR18.PDF; Temperature: -55°C+155°C; Weight: 0.65mg; Height: 0.40MM; Library Ref: RESISTOR; Distributor_part_number: 311-10.0KLRTR-ND; Distributor_name: DIGIKEY; Wattage: 1/16W; Tolerance: 1%; Mfr_name: YAGEO AMERICA; Footprint Ref: RES0402_0-5
R67 = RESISTOR_Dup2: RES 6.19K 1/16W 1% 0402; Part Reference: R67; Manufacturer: YAGEO AMERICA; Part_type: RESISTORS\FIXED; Mfr_part_number: RC0402FR-076K19L; Mistral Part No: 110022010013-R; Custom_Duty: 15%; Customs_HS_Code: 85332119; Voltage: NA; Project: J7AHP_PROTO_BRD; Value: 6.19K_1%; PCB Footprint: RES0402_0-5; Footprint Path: Y:\MIS_DATABASE\Library\ALTIUM_TOOL\PCB_FOOTPRINTS\Altium_Footprint_Lib.PcbLib; Library Path: Y:\MIS_DATABASE\Library\ALTIUM_TOOL\SCHEMATICS_PARTS\MS_DISCRETE_Library.schlib; MECHANICAL 3D STEP FILE: RES0402_0-5; Chkd/date: MANIRAJA/190122; Crtd /date: TAMILARASU/190122; Datasheet: Y:\MIS_DATABASE\DATASHEETS\RESISTORS\RCXXXXL-SER_MAR18.PDF; Temperature: -55°C+155°C; Weight: 0.65mg; Height: 0.40MM; Library Ref: RESISTOR; Distributor_part_number: 311-6.19KLRCT-ND; Distributor_name: DIGIKEY; Wattage: 1/16W; Tolerance: 1%; Mfr_name: YAGEO AMERICA; Footprint Ref: RES0402_0-5
R68 = RESISTOR_Dup2: RES 47.5K 1/16W 1% 0402; Part Reference: R68; Manufacturer: VISHAY; Mistral Part No: 110017010006-R; Mfr_part_number: CRCW040247K5FKED; Part_type: RESISTORS\FIXED; Project: TPR12_SVB; Voltage: NA; Customs_HS_Code: 85332119; Custom_Duty: 15%; Value: 47.5K_1%; PCB Footprint: RES0402_0-5; Footprint Ref: RES0402_0-5; Mfr_name: VISHAY; Tolerance: 1%; Wattage: 1/16W; Distributor_name: DIGIKEY; Distributor_part_number: 541-47.5KLCT-ND; Library Ref: RESISTOR; Height: 0.40MM; Weight: 0.65mg; Temperature: -55°C+155°C; Datasheet: Y:\MIS_DATABASE\DATASHEETS\RESISTORS\CRCW0603.PDF; Crtd /date: MANIRAJA/170320; Chkd/date: MANIRAJA/170320; MECHANICAL 3D STEP FILE: RES0402_0-5; Library Path: Y:\MIS_DATABASE\Library\ALTIUM_TOOL\SCHEMATICS_PARTS\MS_DISCRETE_Library.schlib; Footprint Path: Y:\MIS_DATABASE\Library\ALTIUM_TOOL\PCB_FOOTPRINTS\Altium_Footprint_Lib.PcbLib
R71 = RESISTOR_Dup2: RES 10K 1/16W 1% 0402; Part Reference: R71; Manufacturer: YAGEO AMERICA; Mistral Part No: 110015090015-R; Mfr_part_number: RC0402FR-0710KL; Part_type: RESISTORS\FIXED; Project: VOCERA; Voltage: NA; Customs_HS_Code: 85332119; Custom_Duty: 15%; Value: 10K_1%; PCB Footprint: RES0402_0-5; Footprint Ref: RES0402_0-5; Mfr_name: YAGEO AMERICA; Tolerance: 1%; Wattage: 1/16W; Distributor_name: DIGIKEY; Distributor_part_number: 311-10.0KLRTR-ND; Library Ref: RESISTOR; Height: 0.40MM; Weight: 0.65mg; Temperature: -55°C+155°C; Datasheet: Y:\MIS_DATABASE\DATASHEETS\RESISTORS\RCXXXXL-SER_MAR18.PDF; Crtd /date: GEETHA/290506; Chkd/date: VASANTHA/201216; MECHANICAL 3D STEP FILE: RES0402_0-5; Library Path: Y:\MIS_DATABASE\Library\ALTIUM_TOOL\SCHEMATICS_PARTS\MS_DISCRETE_Library.schlib; Footprint Path: Y:\MIS_DATABASE\Library\ALTIUM_TOOL\PCB_FOOTPRINTS\Altium_Footprint_Lib.PcbLib
R72 = RESISTOR_Dup2: RES 6.19K 1/16W 1% 0402; Part Reference: R72; Manufacturer: YAGEO AMERICA; Mistral Part No: 110022010013-R; Mfr_part_number: RC0402FR-076K19L; Part_type: RESISTORS\FIXED; Project: J7AHP_PROTO_BRD; Voltage: NA; Customs_HS_Code: 85332119; Custom_Duty: 15%; Value: 6.19K_1%; PCB Footprint: RES0402_0-5; Footprint Ref: RES0402_0-5; Mfr_name: YAGEO AMERICA; Tolerance: 1%; Wattage: 1/16W; Distributor_name: DIGIKEY; Distributor_part_number: 311-6.19KLRCT-ND; Library Ref: RESISTOR; Height: 0.40MM; Weight: 0.65mg; Temperature: -55°C+155°C; Datasheet: Y:\MIS_DATABASE\DATASHEETS\RESISTORS\RCXXXXL-SER_MAR18.PDF; Crtd /date: TAMILARASU/190122; Chkd/date: MANIRAJA/190122; MECHANICAL 3D STEP FILE: RES0402_0-5; Library Path: Y:\MIS_DATABASE\Library\ALTIUM_TOOL\SCHEMATICS_PARTS\MS_DISCRETE_Library.schlib; Footprint Path: Y:\MIS_DATABASE\Library\ALTIUM_TOOL\PCB_FOOTPRINTS\Altium_Footprint_Lib.PcbLib
R73 = RESISTOR_Dup2: RES 47K 1/10W 5% 0402; Part Reference: R73; Manufacturer: PANASONIC-ECG; Part_type: RESISTORS\FIXED; Mfr_part_number: ERJ-2GEJ473X; Mistral Part No: 110009030882-R; Custom_Duty: 15%; Customs_HS_Code: 85332119; Voltage: NA; Project: CTP02_REVA_BASE; Value: 47K; PCB Footprint: RES0402_0-5; Footprint Path: Y:\MIS_DATABASE\Library\ALTIUM_TOOL\PCB_FOOTPRINTS\Altium_Footprint_Lib.PcbLib; Library Path: Y:\MIS_DATABASE\Library\ALTIUM_TOOL\SCHEMATICS_PARTS\MS_DISCRETE_Library.schlib; MECHANICAL 3D STEP FILE: RES0402_0-5; Chkd/date: VASANTHA/281216; Crtd /date: MAZHAR/120505; Datasheet: Y:\MIS_DATABASE\DATASHEETS\RESISTORS\PAN-ERJSER_NOV17.PDF; Temperature: -55°C+155°C; Weight: 0.8mg; Height: 0.40MM; Library Ref: RESISTOR; Distributor_part_number: P47KJCT-ND; Distributor_name: DIGIKEY; Wattage: 1/10W; Tolerance: 5%; Mfr_name: PANASONIC-ECG; Footprint Ref: RES0402_0-5
R74 = RESISTOR_Dup2: RES 6.19K 1/16W 1% 0402; Part Reference: R74; Manufacturer: YAGEO AMERICA; Part_type: RESISTORS\FIXED; Mfr_part_number: RC0402FR-076K19L; Mistral Part No: 110022010013-R; Custom_Duty: 15%; Customs_HS_Code: 85332119; Voltage: NA; Project: J7AHP_PROTO_BRD; Value: 6.19K_1%; PCB Footprint: RES0402_0-5; Footprint Path: Y:\MIS_DATABASE\Library\ALTIUM_TOOL\PCB_FOOTPRINTS\Altium_Footprint_Lib.PcbLib; Library Path: Y:\MIS_DATABASE\Library\ALTIUM_TOOL\SCHEMATICS_PARTS\MS_DISCRETE_Library.schlib; MECHANICAL 3D STEP FILE: RES0402_0-5; Chkd/date: MANIRAJA/190122; Crtd /date: TAMILARASU/190122; Datasheet: Y:\MIS_DATABASE\DATASHEETS\RESISTORS\RCXXXXL-SER_MAR18.PDF; Temperature: -55°C+155°C; Weight: 0.65mg; Height: 0.40MM; Library Ref: RESISTOR; Distributor_part_number: 311-6.19KLRCT-ND; Distributor_name: DIGIKEY; Wattage: 1/16W; Tolerance: 1%; Mfr_name: YAGEO AMERICA; Footprint Ref: RES0402_0-5
R76 = RESISTOR_Dup2: RES 20K 1/16W 1% 0402; Part Reference: R76; Part_type: RESISTORS\FIXED; Mfr_part_number: RC0402FR-0720KL; Mfr_name: YAGEO AMERICA; Mistral Part No: 110009030486-R; Custom_Duty: 15%; Customs_HS_Code: 85332119; Voltage: NA; Project: TELEMETRY ENCODER; Value: 20K_1%; PCB Footprint: RES0402_0-5; Footprint Path: Y:\MIS_DATABASE\Library\ALTIUM_TOOL\PCB_FOOTPRINTS\Altium_Footprint_Lib.PcbLib; Library Path: Y:\MIS_DATABASE\Library\ALTIUM_TOOL\SCHEMATICS_PARTS\MS_DISCRETE_Library.schlib; MECHANICAL 3D STEP FILE: RES0402_0-5; Chkd/date: MAZHAR/280108; Crtd /date: USMAN/280108; Datasheet: Y:\MIS_DATABASE\DATASHEETS\RESISTORS\RCXXXXL-SER_MAR18.PDF; Temperature: -55°C+155°C; Weight: 0.65mg; Height: 0.40MM; Library Ref: RESISTOR; Distributor_part_number: 311-20.0KLRCT-ND; Distributor_name: DIGIKEY; Wattage: 1/16W; Tolerance: 1%; Footprint Ref: RES0402_0-5
R334 = RESISTOR_Dup2: RES 1K 1/10W 1% 0402; Part Reference: R334; Manufacturer: PANASONIC-ECG; Mistral Part No: 110009030411-R; Mfr_part_number: ERJ-2RKF1001X; Part_type: RESISTORS\FIXED; Project: VOCERA; Voltage: NA; Customs_HS_Code: 85332119; Custom_Duty: 15%; Value: 1K_1%; PCB Footprint: RES0402_0-5; Footprint Ref: RES0402_0-5; Mfr_name: PANASONIC-ECG; Tolerance: 1%; Wattage: 1/10W; Distributor_name: DIGIKEY; Distributor_part_number: P1.00KLCT-ND; Library Ref: RESISTOR; Height: 0.40MM; Weight: 0.8mg; Temperature: -55°C+155°C; Datasheet: Y:\MIS_DATABASE\DATASHEETS\RESISTORS\PAN-ERJSER_NOV17.PDF; Crtd /date: MAZHAR/150506; Chkd/date: VASANTHA/281216; MECHANICAL 3D STEP FILE: RES0402_0-5; Library Path: Y:\MIS_DATABASE\Library\ALTIUM_TOOL\SCHEMATICS_PARTS\MS_DISCRETE_Library.schlib; Footprint Path: Y:\MIS_DATABASE\Library\ALTIUM_TOOL\PCB_FOOTPRINTS\Altium_Footprint_Lib.PcbLib
R335 = RESISTOR_Dup2: RES 10K 1/16W 1% 0402; Part Reference: R335; Manufacturer: YAGEO AMERICA; Part_type: RESISTORS\FIXED; Mfr_part_number: RC0402FR-0710KL; Mistral Part No: 110015090015-R; Custom_Duty: 15%; Customs_HS_Code: 85332119; Voltage: NA; Project: VOCERA; Value: 10K_1%; PCB Footprint: RES0402_0-5; Footprint Path: Y:\MIS_DATABASE\Library\ALTIUM_TOOL\PCB_FOOTPRINTS\Altium_Footprint_Lib.PcbLib; Library Path: Y:\MIS_DATABASE\Library\ALTIUM_TOOL\SCHEMATICS_PARTS\MS_DISCRETE_Library.schlib; MECHANICAL 3D STEP FILE: RES0402_0-5; Chkd/date: VASANTHA/201216; Crtd /date: GEETHA/290506; Datasheet: Y:\MIS_DATABASE\DATASHEETS\RESISTORS\RCXXXXL-SER_MAR18.PDF; Temperature: -55°C+155°C; Weight: 0.65mg; Height: 0.40MM; Library Ref: RESISTOR; Distributor_part_number: 311-10.0KLRTR-ND; Distributor_name: DIGIKEY; Wattage: 1/16W; Tolerance: 1%; Mfr_name: YAGEO AMERICA; Footprint Ref: RES0402_0-5
R516 = RESISTOR_Dup2: RES 10K 1/16W 1% 0402; Part Reference: R516; Mistral Part No: 110015090015-R; Mfr_name: YAGEO AMERICA; Mfr_part_number: RC0402FR-0710KL; Part_type: RESISTORS\FIXED; Project: VOCERA; Voltage: NA; Customs_HS_Code: 85332119; Custom_Duty: 15%; Value: 10K_1%; PCB Footprint: RES0402_0-5; Footprint Ref: RES0402_0-5; Tolerance: 1%; Wattage: 1/16W; Package: 0402; Distributor_name: DIGIKEY; Distributor_part_number: 311-10.0KLRTR-ND; Library Ref: RESISTOR; Height: 0.40MM; Weight: 0.65mg; Temperature: -55°C+155°C; Datasheet: Y:\MIS_DATABASE\DATASHEETS\RESISTORS\RCXXXXL-SER_MAR18.PDF; Crtd /date: GEETHA/290506; Chkd/date: VASANTHA/201216; MECHANICAL 3D STEP FILE: RES0402_0-5; Library Path: Y:\MIS_DATABASE\Library\ALTIUM_TOOL\SCHEMATICS_PARTS\MS_DISCRETE_Library.schlib; Footprint Path: Y:\MIS_DATABASE\Library\ALTIUM_TOOL\PCB_FOOTPRINTS\Altium_Footprint_Lib.PcbLib
TP22 = TESTPOINT_Dup1: TESTPOINT CIR 30 SMD; Part Reference: TP22; Manufacturer: LOCAL; Mistral Part No: 130009030930; Project: BT MODULE_CSRBC04; Tolerance: NA; Value: TP30_SMD; PCB Footprint: TP30_SMD; Footprint Ref: TP30_SMD; Mfr_name: LOCAL; Mfr_part_number: TP30_SMD; Part_type: TESTPOINT; Voltage: NA; Wattage: NA; Package: SMD; Distributor_name: NA; Distributor_part_number: NA; Library Ref: TESTPOINT; Height: NA; Weight: NA; Temperature: NA; Datasheet: NA; Crtd /date: MAZHAR/171006; Chkd/date: SHREESHAIL/171006; RoHS: NA; Customs_HS_Code: NA; Custom_Duty: NA; MECHANICAL 3D STEP FILE: NA; Library Path: Y:\MIS_DATABASE\Library\ALTIUM_TOOL\SCHEMATICS_PARTS\MS_DISCRETE_Library.schlib; Footprint Path: Y:\MIS_DATABASE\Library\ALTIUM_TOOL\PCB_FOOTPRINTS\Altium_Footprint_Lib.PcbLib
U13 = TPS62872-Q1_VQFN16: IC 2.7-6V INPUT 15A STACKABLE FAST TRANSIENT SYNCHRONOUS STEP-DOWN DC-DC CONVERTER VQFN16; Part Reference: U13; Manufacturer: TEXAS INSTRUMENTS; Part_type: ICS\POWER\DC-DC CONVERTER; Mistral Part No: 142022030022; Custom_Duty: 15%; Customs_HS_Code: 85423100; Wattage: NA; Project: TI_J7AHP_EVM_BRD; Remarks: CREATED SAME AS  TPS62873QWRXSR-Q1; Value: TPS62873Y1QWRXSRQ1; PCB Footprint: VQFN16_TPS62872-Q1_100X140_1-1; Footprint Path: Y:\MIS_DATABASE\Library\ALTIUM_TOOL\PCB_FOOTPRINTS\Altium_Footprint_Lib.PcbLib; Library Path: Y:\MIS_DATABASE\Library\ALTIUM_TOOL\SCHEMATICS_PARTS\MS_MISCPOWER_Library.schlib; MECHANICAL 3D STEP FILE: VQFN16_TPS62872-Q1_100X140_1-1; RoHS: NA; Chkd/date: ALVY/280322; Crtd /date: ALVY/280322; Datasheet: Y:\MIS_DATABASE\DATASHEETS\ICS\POWER\TPS6287X-Q1.PDF; Temperature: -40°C+150°C; Weight: NA; Height: 1.05MM; Library Ref: TPS62872-Q1_VQFN16; Distributor_part_number: NA; Distributor_name: NA; Package: VQFN16; Voltage: NA; Tolerance: NA; Mfr_part_number: TPS62873Y1QWRXSRQ1; Mfr_name: TEXAS INSTRUMENTS; Footprint Ref: VQFN16_TPS62872-Q1_100X140_1-1
U14 = TPS62872-Q1_VQFN16: IC 2.7-6V INPUT 15A STACKABLE FAST TRANSIENT SYNCHRONOUS STEP-DOWN DC-DC CONVERTER VQFN16; Part Reference: U14; Manufacturer: TEXAS INSTRUMENTS; Part_type: ICS\POWER\DC-DC CONVERTER; Mistral Part No: 142022030022; Custom_Duty: 15%; Customs_HS_Code: 85423100; Wattage: NA; Project: TI_J7AHP_EVM_BRD; Remarks: CREATED SAME AS  TPS62873QWRXSR-Q1; Value: TPS62873Y1QWRXSRQ1; PCB Footprint: VQFN16_TPS62872-Q1_100X140_1-1; Footprint Path: Y:\MIS_DATABASE\Library\ALTIUM_TOOL\PCB_FOOTPRINTS\Altium_Footprint_Lib.PcbLib; Library Path: Y:\MIS_DATABASE\Library\ALTIUM_TOOL\SCHEMATICS_PARTS\MS_MISCPOWER_Library.schlib; MECHANICAL 3D STEP FILE: VQFN16_TPS62872-Q1_100X140_1-1; RoHS: NA; Chkd/date: ALVY/280322; Crtd /date: ALVY/280322; Datasheet: Y:\MIS_DATABASE\DATASHEETS\ICS\POWER\TPS6287X-Q1.PDF; Temperature: -40°C+150°C; Weight: NA; Height: 1.05MM; Library Ref: TPS62872-Q1_VQFN16; Distributor_part_number: NA; Distributor_name: NA; Package: VQFN16; Voltage: NA; Tolerance: NA; Mfr_part_number: TPS62873Y1QWRXSRQ1; Mfr_name: TEXAS INSTRUMENTS; Footprint Ref: VQFN16_TPS62872-Q1_100X140_1-1
U15 = TPS62872-Q1_VQFN16: IC 2.7-6V INPUT 15A STACKABLE FAST TRANSIENT SYNCHRONOUS STEP-DOWN DC-DC CONVERTER VQFN16; Part Reference: U15; Manufacturer: TEXAS INSTRUMENTS; Part_type: ICS\POWER\DC-DC CONVERTER; Mistral Part No: 142022030022; Custom_Duty: 15%; Customs_HS_Code: 85423100; Wattage: NA; Project: TI_J7AHP_EVM_BRD; Remarks: CREATED SAME AS  TPS62873QWRXSR-Q1; Value: TPS62873Y1QWRXSRQ1; PCB Footprint: VQFN16_TPS62872-Q1_100X140_1-1; Footprint Path: Y:\MIS_DATABASE\Library\ALTIUM_TOOL\PCB_FOOTPRINTS\Altium_Footprint_Lib.PcbLib; Library Path: Y:\MIS_DATABASE\Library\ALTIUM_TOOL\SCHEMATICS_PARTS\MS_MISCPOWER_Library.schlib; MECHANICAL 3D STEP FILE: VQFN16_TPS62872-Q1_100X140_1-1; RoHS: NA; Chkd/date: ALVY/280322; Crtd /date: ALVY/280322; Datasheet: Y:\MIS_DATABASE\DATASHEETS\ICS\POWER\TPS6287X-Q1.PDF; Temperature: -40°C+150°C; Weight: NA; Height: 1.05MM; Library Ref: TPS62872-Q1_VQFN16; Distributor_part_number: NA; Distributor_name: NA; Package: VQFN16; Voltage: NA; Tolerance: NA; Mfr_part_number: TPS62873Y1QWRXSRQ1; Mfr_name: TEXAS INSTRUMENTS; Footprint Ref: VQFN16_TPS62872-Q1_100X140_1-1
U46 = MOSFET_2N7002BK: TRANSISTOR MOSFET N-CHANNEL 50V 200mA SOT-416F; Part Reference: U46; Part_type: TRANSISTOR\MOSFET; Manufacturer: ROHM; Mistral Part No: 130022020037-R; Custom_Duty: 15%; Customs_HS_Code: 85423100; Wattage: NA; Project: TI_J7AHP_EVM_BRD; Value: RE1J002YNTCL; PCB Footprint: SOT416F-6_0-9; Footprint Path: Y:\MIS_DATABASE\Library\ALTIUM_TOOL\PCB_FOOTPRINTS\Altium_Footprint_Lib.PcbLib; Library Path: Y:\MIS_DATABASE\Library\ALTIUM_TOOL\SCHEMATICS_PARTS\MS_MOSFET_Library.schlib; MECHANICAL 3D STEP FILE: SOT416F-6_0-9; Chkd/date: ALVY/220222; Crtd /date: TAMILARASU/180222; Datasheet: Y:\MIS_DATABASE\DATASHEETS\DISCRETES\TRANSISTORS_FETS\RE1J002YN.PDF; Temperature: -55°C+150°C; Weight: 2.4mg; Height: 0.85MM; Library Ref: MOSFET_2N7002BK; Distributor_part_number: RE1J002YNTCLCT-ND; Distributor_name: DIGIKEY; Package: SOT-416F; Voltage: NA; Tolerance: NA; Mfr_part_number: RE1J002YNTCL; Footprint Ref: SOT416F-6_0-9; Mfr_name: ROHM
U100 = MOSFET_2N7002BK: TRANSISTOR MOSFET N-CHANNEL 50V 200mA SOT-416F; Part Reference: U100; Part_type: TRANSISTOR\MOSFET; Manufacturer: ROHM; Mistral Part No: 130022020037-R; Custom_Duty: 15%; Customs_HS_Code: 85423100; Wattage: NA; Project: TI_J7AHP_EVM_BRD; Value: RE1J002YNTCL; PCB Footprint: SOT416F-6_0-9; Footprint Path: Y:\MIS_DATABASE\Library\ALTIUM_TOOL\PCB_FOOTPRINTS\Altium_Footprint_Lib.PcbLib; Library Path: Y:\MIS_DATABASE\Library\ALTIUM_TOOL\SCHEMATICS_PARTS\MS_MOSFET_Library.schlib; MECHANICAL 3D STEP FILE: SOT416F-6_0-9; Chkd/date: ALVY/220222; Crtd /date: TAMILARASU/180222; Datasheet: Y:\MIS_DATABASE\DATASHEETS\DISCRETES\TRANSISTORS_FETS\RE1J002YN.PDF; Temperature: -55°C+150°C; Weight: 2.4mg; Height: 0.85MM; Library Ref: MOSFET_2N7002BK; Distributor_part_number: RE1J002YNTCLCT-ND; Distributor_name: DIGIKEY; Package: SOT-416F; Voltage: NA; Tolerance: NA; Mfr_part_number: RE1J002YNTCL; Footprint Ref: SOT416F-6_0-9; Mfr_name: ROHM